# Altium schematic sheet SCH Front.SchDoc
size Legal; SheetNumber: 1; SheetTotal: 1
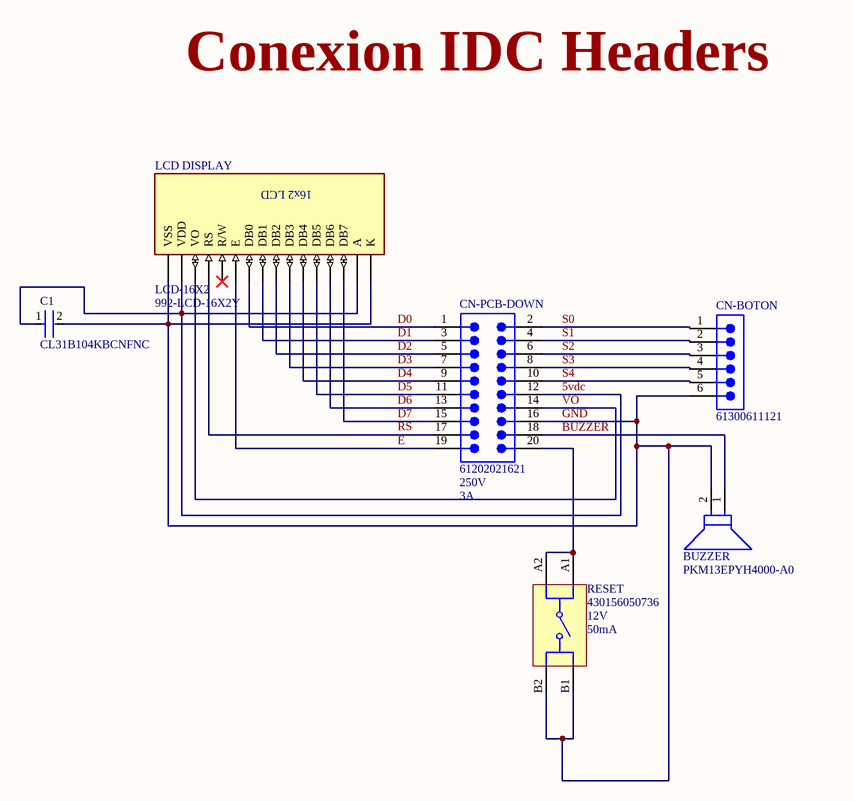
[diagram p0: SCH Front.SchDoc]

## Parts
BUZZER  PKM13EPYH4000-A0  [FP-PKM13EPYH4000-A0-MFG]
C1  CL31B104KBCNFNC  [FP-CL31-IPC_C]
CN-BOTON  61300611121  [61300611121]
CN-PCB-DOWN  61202021621  Voltage Rating (DC): 250V  Current Rating: 3A  [61202021621]
LCD_DISPLAY  LCD-16X2  Supplier Part Number 1: 992-LCD-16X2Y  [MODULE_LCD-16X2]
RESET  430156050736  Voltage Rating: 12V  Current Rating: 50mA  [4301x60507x6]

## Nets
5vdc: C1.1 CN-PCB-DOWN.12 LCD_DISPLAY.2(VDD) LCD_DISPLAY.15(A)
BUZZER: BUZZER.1 CN-PCB-DOWN.18
D0: CN-PCB-DOWN.1 LCD_DISPLAY.7(DB0)
D1: CN-PCB-DOWN.3 LCD_DISPLAY.8(DB1)
D2: CN-PCB-DOWN.5 LCD_DISPLAY.9(DB2)
D3: CN-PCB-DOWN.7 LCD_DISPLAY.10(DB3)
D4: CN-PCB-DOWN.9 LCD_DISPLAY.11(DB4)
D5: CN-PCB-DOWN.11 LCD_DISPLAY.12(DB5)
D6: CN-PCB-DOWN.13 LCD_DISPLAY.13(DB6)
D7: CN-PCB-DOWN.15 LCD_DISPLAY.14(DB7)
E: CN-PCB-DOWN.19 LCD_DISPLAY.6(E)
GND: BUZZER.2 C1.2 CN-BOTON.6 CN-PCB-DOWN.16 LCD_DISPLAY.1(VSS) LCD_DISPLAY.16(K) RESET.B1 RESET.B2
RS: CN-PCB-DOWN.17 LCD_DISPLAY.4(RS)
S0: CN-BOTON.1 CN-PCB-DOWN.2
S1: CN-BOTON.2 CN-PCB-DOWN.4
S2: CN-BOTON.3 CN-PCB-DOWN.6
S3: CN-BOTON.4 CN-PCB-DOWN.8
S4: CN-BOTON.5 CN-PCB-DOWN.10
VO: CN-PCB-DOWN.14 LCD_DISPLAY.3(VO)
NetCN-PCB-DOWN_20: CN-PCB-DOWN.20 RESET.A1 RESET.A2

Not connected (* = marked no-connect by the designer): LCD_DISPLAY 5(R/W)*

## Notes on the sheet
- Conexion IDC Headers
- (in symbol LCD-16X2) 16x2 LCD

## Library data of the parts
BUZZER = CMP-06202-000019-1: AUDIO PIEZO TRANSDUCER 30V TH; Washable: No; Max Frequency: 4kHz; Max Supply Voltage: 25V; Nominal Input Voltage: 3V; Capacitance: 5.5nF; Lead Free: Lead Free; Radiation Hardening: No; Max Operating Temperature: 85°C; Height: 6.9mm; Mount: Through Hole; Voltage Rating: 3V; Diameter: 12.6mm; Self Resonant Frequency: 4kHz; Packaging: Bulk; REACH SVHC: No SVHC; Package Quantity: 500; Min Operating Temperature: -40°C; Frequency: 4kHz; Voltage Rating (DC): 30V; Termination: Solder
C1 = CMP-13271-001276-1: Cap Ceramic 100nF 50V X7R ±10% SMD 1206 +125°C Embossed T/R; Dielectric: X7R; Case Code (Metric): 3216; Package Quantity: 1; Thickness: 0.037inch; Depth: 1.6mm; Packaging: Tape and Reel; Capacitance: 100nF; Length: 0.126inch; Tolerance: 10%; Voltage Rating: 50V; Case Code (Imperial): 1206; Radiation Hardening: No; Width: 0.063inch; Case/Package: 1206; Max Operating Temperature: 125°C; Min Operating Temperature: -55°C; Height: 0.85mm; Mount: Surface Mount
CN-BOTON = CMP-1502-01070-3: NexarPartId: 20084590; Current Rating: 3A; Pitch: 2.54mm; Gender: Male; Operating Supply Voltage: 250V; Connector Type: Male Pin; Number of Positions: 6; Contact Resistance: 20mΩ; Packaging: Bulk; Number of Pins: 6; Number of Rows: 1; Contact Plating: Gold; Lead Free: Lead Free; RoHS: Compliant; Contact Mating Length: 5.9944mm; Voltage Rating: 250V; REACH SVHC: Unknown; Contact Gender: Male; Housing Material: PBT; Min Operating Temperature: -40°C; Lead Pitch: 2.54mm; Mount: Through Hole; Number of Contacts: 6; Max Operating Temperature: 105°C; Contact Material: Copper; Orientation: Vertical; Termination: Through Hole; Color: Black; Height: 8.89mm
CN-PCB-DOWN = CMP-1502-00010-2: NexarPartId: 8917785; Number of Positions: 20; Row Spacing: 2.54mm; Gender: Male; Insulation Resistance: 1GΩ; Connector Type: Male Pin; Contact Resistance: 20mΩ; Insulation: Insulated; System: Connector; Contact Material: Copper; REACH SVHC: Unknown; Width: 33.06mm; Pitch: 2.54mm; Housing Material: PBT; Number of Contacts: 20; Contact Plating: Gold; Mount: Through Hole; Termination: Through Hole; Number of Pins: 20; Color: Black; Max Operating Temperature: 105°C; Contact Gender: Male; Voltage Rating: 250V; Lead Pitch: 2.54mm; Operating Supply Voltage: 250V; Length: 33.06mm; Orientation: Vertical; Number of Rows: 2; Flammability Rating: UL94 V-0; RoHS: Compliant; Insulation Material: PBT; Min Operating Temperature: -40°C; Height: 8.85mm
LCD_DISPLAY = LCD-16X2: Display Development Tools 16x2 Black on Green Char LCD w Backlight; Manufacturer Part Number: LCD-16X2Y; MF: Gravitech; Operating Supply Voltage: 5V; Interface: Parallel; Package: None; Price: None; Value: *; SnapEDA_Link: https://www.snapeda.com/parts/LCD-16X2/Gravitech/view-part/?ref=snap; MP: LCD-16X2; Availability: Not in stock; Check_prices: https://www.snapeda.com/parts/LCD-16X2/Gravitech/view-part/?ref=eda; Supplier 1: Mouser; Manufacturer: Gravitech; RoHS: Yes; ComponentLink1URL: http://www.gravitech.us/16chblongrlc.html?src-supplier=Mouser; ComponentLink1Description: http://www.gravitech.us/16chblongrlc.html?src-supplier=Mouser
RESET = CMP-1453-00004-2: NexarPartId: 38794700; Illumination Type: Illuminated, Non-Illuminated; Mechanical Life: 200kcycles; Actuator Material: Liquid Crystal Polymer, Polymer; Throw Configuration: SPST; Insulation Resistance: 100MΩ; Switch Function: Off-Mom; Switch Travel: 250µm; Contact Current Rating: 50mA; Height: 5mm; RoHS: Compliant; Width: 6.2mm; Contact Material: Steel; Max Operating Temperature: 85°C; Mount: Through Hole; REACH SVHC: No SVHC; Termination: PC Pin; Min Operating Temperature: -40°C; Length: 6.2mm; Diameter: 3.5mm; Packaging: Bulk; Contact Plating: Silver